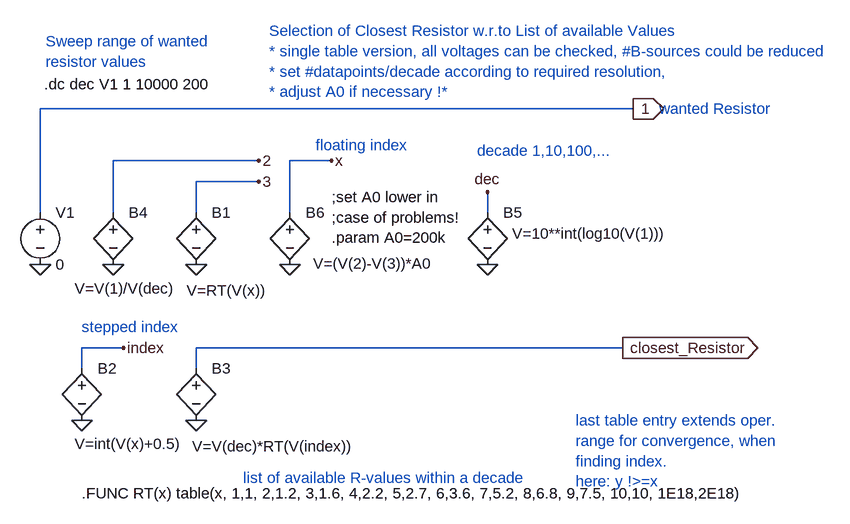
[diagram p0: schematic Select_resistor_from_list_V2.asc]
Select_resistor_from_list_V2.asc, the LTspice schematic file:
Version 4
SHEET 1 1696 680
WIRE 112 128 112 -32
WIRE 176 368 176 336
WIRE 224 128 224 48
WIRE 240 336 176 336
WIRE 352 128 352 80
WIRE 352 368 352 336
WIRE 448 48 224 48
WIRE 448 80 352 80
WIRE 496 128 496 48
WIRE 560 48 496 48
WIRE 800 128 800 96
WIRE 1008 336 352 336
WIRE 1024 -32 112 -32
FLAG 112 208 0
FLAG 352 208 0
FLAG 1024 -32 1
IOPIN 1024 -32 Out
FLAG 448 80 3
FLAG 560 48 x
FLAG 176 448 0
FLAG 240 336 index
FLAG 352 448 0
FLAG 1008 336 closest_Resistor
IOPIN 1008 336 Out
FLAG 224 208 0
FLAG 448 48 2
FLAG 800 208 0
FLAG 800 96 dec
FLAG 496 208 0
SYMBOL voltage 112 112 R0
WINDOW 123 0 0 Left 0
WINDOW 39 0 0 Left 0
SYMATTR InstName V1
SYMATTR Value 0
SYMBOL bv 352 112 R0
WINDOW 3 -15 136 Left 0
SYMATTR Value V=RT(V(x))
SYMATTR InstName B1
SYMBOL bv 176 352 R0
WINDOW 3 -11 132 Left 0
SYMATTR Value V=int(V(x)+0.5)
SYMATTR InstName B2
SYMBOL bv 352 352 R0
WINDOW 3 -6 136 Left 0
SYMATTR Value V=V(dec)*RT(V(index))
SYMATTR InstName B3
SYMBOL bv 224 112 R0
WINDOW 3 -59 133 Left 0
SYMATTR Value V=V(1)/V(dec)
SYMATTR InstName B4
SYMBOL bv 800 112 R0
WINDOW 3 38 48 Left 0
SYMATTR Value V=10**int(log10(V(1)))
SYMATTR InstName B5
SYMBOL bv 496 112 R0
WINDOW 3 36 94 Left 0
SYMATTR Value V=(V(2)-V(3))*A0
SYMATTR InstName B6
TEXT 118 -70 Left 0 !.dc dec V1 1 10000 200
TEXT 1064 -32 Left 0 ;wanted Resistor
TEXT 464 -152 Left 0 ;Selection of Closest Resistor w.r.to List of available Values\n* single table version, all voltages can be checked, #B-sources could be reduced\n* set #datapoints/decade according to required resolution,\n* adjust A0 if necessary !*
TEXT 784 32 Left 0 ;decade 1,10,100,...
TEXT 536 24 Left 0 ;floating index
TEXT 176 304 Left 0 ;stepped index
TEXT 424 536 Left 0 ;list of available R-values within a decade
TEXT 560 104 Left 0 !;set A0 lower in\n;case of problems!\n.param A0=200k
TEXT 936 448 Left 0 ;last table entry extends oper.\nrange for convergence, when\nfinding index.\nhere: y !>=x
TEXT 120 -136 Left 0 ;Sweep range of wanted\nresistor values
TEXT 176 560 Left 0 !.FUNC RT(x) table(x, 1,1, 2,1.2, 3,1.6, 4,2.2, 5,2.7, 6,3.6, 7,5.2, 8,6.8, 9,7.5, 10,10, 1E18,2E18)

The netlist it stands for:
* Select_resistor_from_list_V2.asc
V1 1 0 0
B1 3 0 V=RT(V(x))
B2 index 0 V=int(V(x)+0.5)
B3 closest_Resistor 0 V=V(dec)*RT(V(index))
B4 2 0 V=V(1)/V(dec)
B5 dec 0 V=10**int(log10(V(1)))
B6 x 0 V=(V(2)-V(3))*A0
.dc dec V1 1 10000 200
* wanted Resistor
* Selection of Closest Resistor w.r.to List of available Values
* * single table version, all voltages can be checked, #B-sources could be reduced
* * set #datapoints/decade according to required resolution,
* * adjust A0 if necessary !*
* decade 1,10,100,...
* floating index
* stepped index
* list of available R-values within a decade
;set A0 lower in
;case of problems!
.param A0=200k
* last table entry extends oper.
* range for convergence, when
* finding index.
* here: y !>=x
* Sweep range of wanted
* resistor values
.FUNC RT(x) table(x, 1,1, 2,1.2, 3,1.6, 4,2.2, 5,2.7, 6,3.6, 7,5.2, 8,6.8, 9,7.5, 10,10, 1E18,2E18)
.backanno
.end